# EAGLE design Bandit the Racoon (EAGLE 7.3.0)

## Sheet 1 of 3: Atmega328 + CP2102
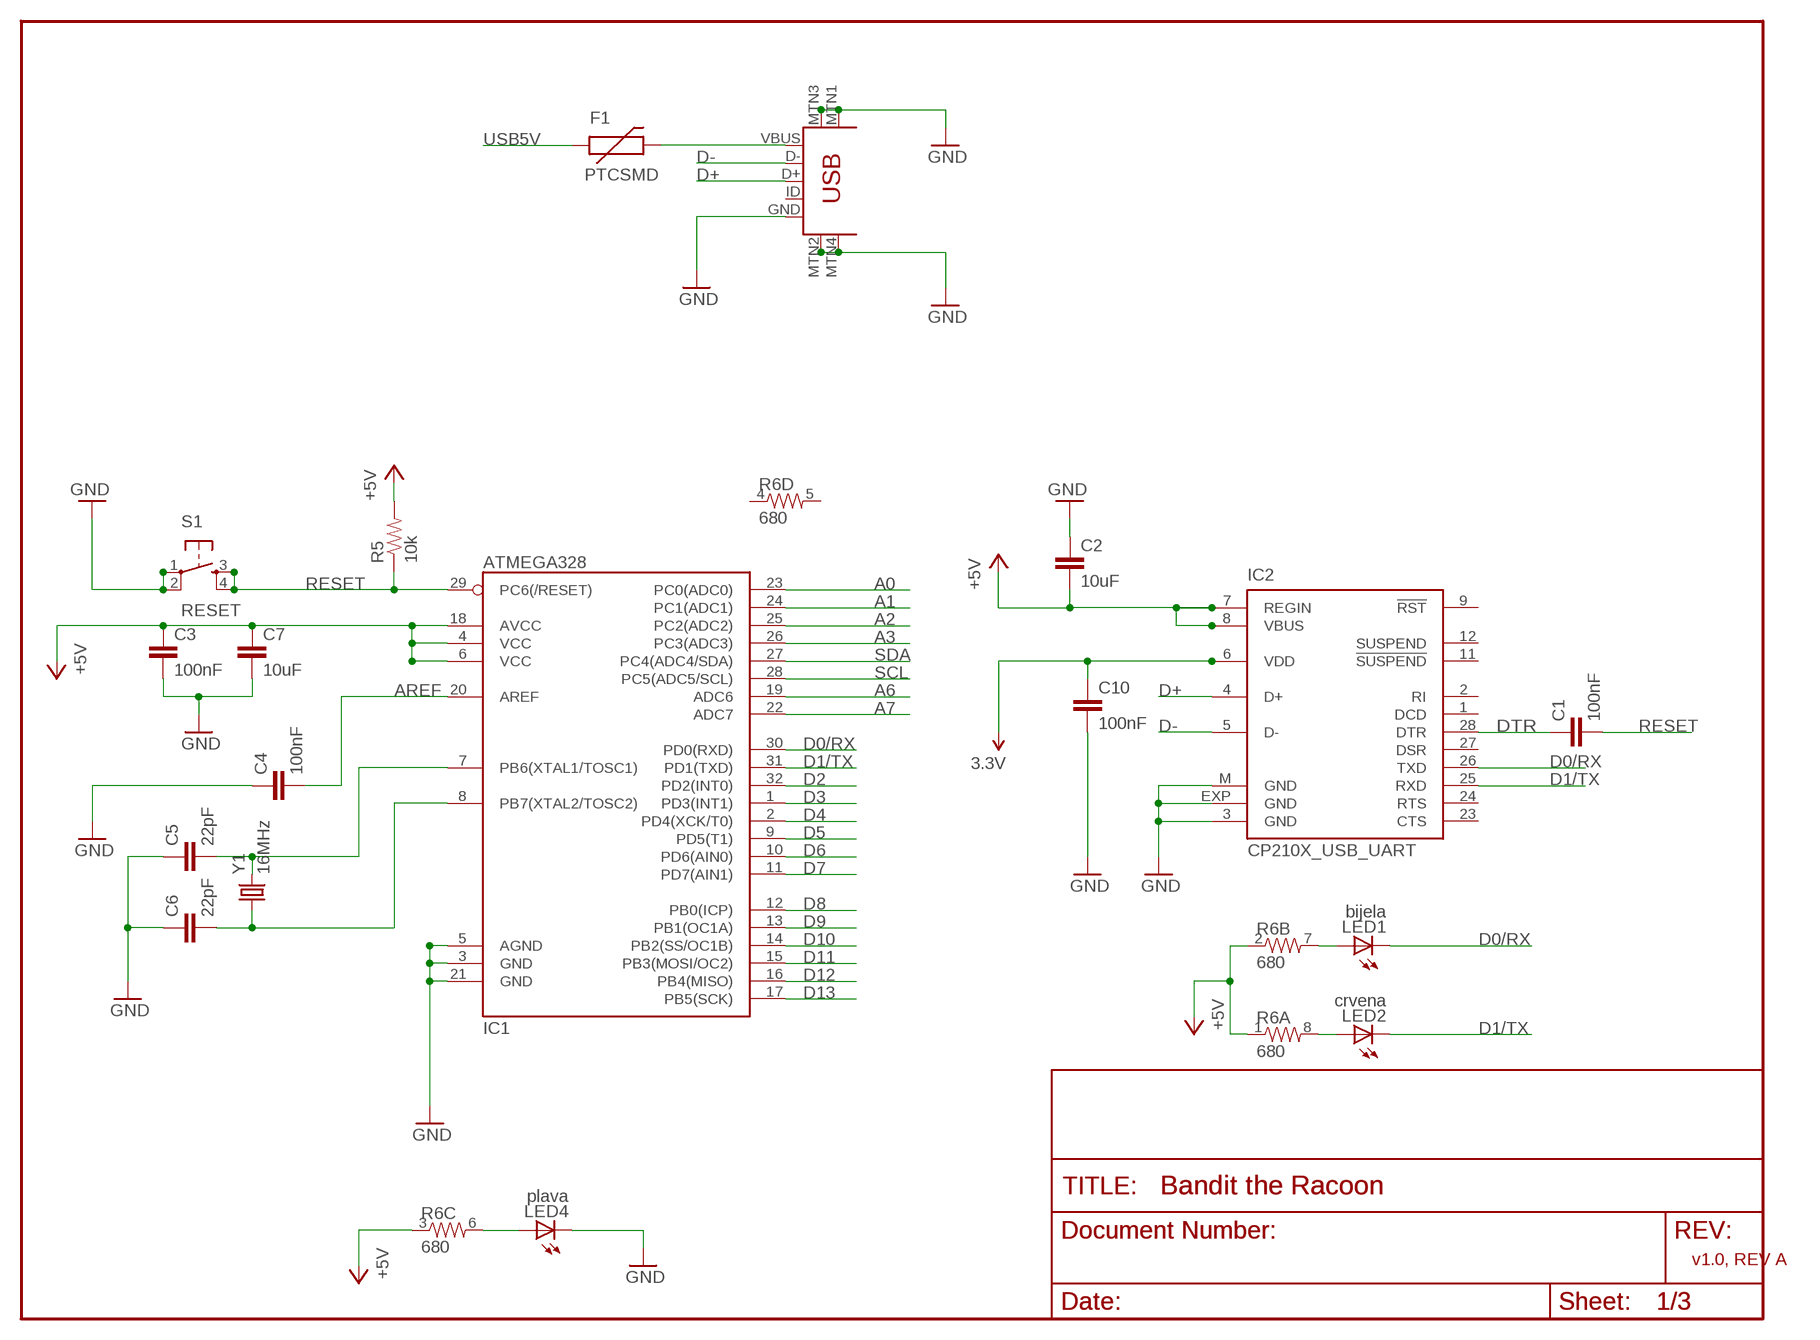
[diagram p0: schematic, sheet 1]

### Parts
C1  100nF  CAP0603-CAP  [0603-CAP]
C2  10uF  C-EUC3216  [C3216]
C3  100nF  CAP0603-CAP  [0603-CAP]
C4  100nF  CAP0603-CAP  [0603-CAP]
C5  22pF  CAP0603-CAP  [0603-CAP]
C6  22pF  CAP0603-CAP  [0603-CAP]
C7  10uF  C-EUC3216  [C3216]
C10  100nF  CAP0603-CAP  [0603-CAP]
F1  PTCSMD  [PTC-1206]
IC1  ATMEGA328  ATMEGA168  [TQFP32-08]
IC2  CP210X_USB_UART  [MLP28]
LED1  bijela  LEDCHIP-LED0805  [CHIP-LED0805]
LED2  crvena  LEDCHIP-LED0805  [CHIP-LED0805]
LED4  plava  LEDCHIP-LED0805  [CHIP-LED0805]
R5  10k  RESISTOR0603-RES  [0603-RES]
R6  680  RESISTOR-ARRAY0603-ARV  [0603-ARV]
S1  RESET  TAC_SWITCHSMD  [TACTILE_SWITCH_SMD]
U1  USB-MINIB  USB-MINIB-5PIN  [USB-MINIB]
Y1  16MHz  CRYSTAL5X3  [CRYSTAL-SMD-5X3]

### Nets
3.3V: C10.1 IC2.6(VDD) ; also sheet 3
+5V: C2.2 C3.1 C7.1 IC1.4(VCC) IC1.6(VCC) IC1.18(AVCC) IC2.7(REGIN) IC2.8(VBUS) R5.2 R6.1 R6.2 R6.3 ; also sheet 2,3
A0: IC1.23(PC0(ADC0)) ; also sheet 3
A1: IC1.24(PC1(ADC1)) ; also sheet 2
A2: IC1.25(PC2(ADC2)) ; also sheet 2
A3: IC1.26(PC3(ADC3)) ; also sheet 3
A6: IC1.19(ADC6)
A7: IC1.22(ADC7)
AREF: C4.2 IC1.20(AREF)
CRYSTAL1: C5.2 IC1.7(PB6(XTAL1/TOSC1)) Y1.3
CRYSTAL2: C6.2 IC1.8(PB7(XTAL2/TOSC2)) Y1.1
D0/RX: IC1.30(PD0(RXD)) IC2.26(TXD) LED1.C ; also sheet 3
D1/TX: IC1.31(PD1(TXD)) IC2.25(RXD) LED2.C ; also sheet 3
D2: IC1.32(PD2(INT0)) ; also sheet 3
D3: IC1.1(PD3(INT1)) ; also sheet 3
D4: IC1.2(PD4(XCK/T0)) ; also sheet 2
D5: IC1.9(PD5(T1)) ; also sheet 3
D6: IC1.10(PD6(AIN0))
D7: IC1.11(PD7(AIN1))
D8: IC1.12(PB0(ICP))
D9: IC1.13(PB1(OC1A)) ; also sheet 3
D10: IC1.14(PB2(SS/OC1B))
D11: IC1.15(PB3(MOSI/OC2))
D12: IC1.16(PB4(MISO))
D13: IC1.17(PB5(SCK))
D+: IC2.4(D+) U1.D+
D-: IC2.5(D-) U1.D-
DTR: C1.1 IC2.28(DTR) ; also sheet 3
GND: C2.1 C3.2 C4.1 C5.1 C6.1 C7.2 C10.2 IC1.3(GND) IC1.5(AGND) IC1.21(GND) IC2.3(GND) IC2.EXP(GND) IC2.M(GND) LED4.C S1.1 S1.2 U1.GND U1.MTN1(MTN2) U1.MTN2(MTN3) U1.MTN3(MTN1) U1.MTN4 ; also sheet 2,3
N$1: LED1.A R6.7
N$2: LED2.A R6.8
N$6: F1.2 U1.VBUS
PLV_LED: LED4.A R6.6
RESET: C1.2 IC1.29(PC6(/RESET)) R5.1 S1.3 S1.4
SCL: IC1.28(PC5(ADC5/SCL)) ; also sheet 3
SDA: IC1.27(PC4(ADC4/SDA)) ; also sheet 3
USB5V: F1.1 ; also sheet 2
Unconnected: IC2.1(DCD) IC2.2(RI) IC2.9(!RST) IC2.11(!SUSPEND) IC2.12(SUSPEND) IC2.23(CTS) IC2.24(RTS) IC2.27(DSR) R6.4 R6.5 U1.ID

### Notes on the sheet
- v1.0, REV A

## Sheet 2 of 3: Battery Charger
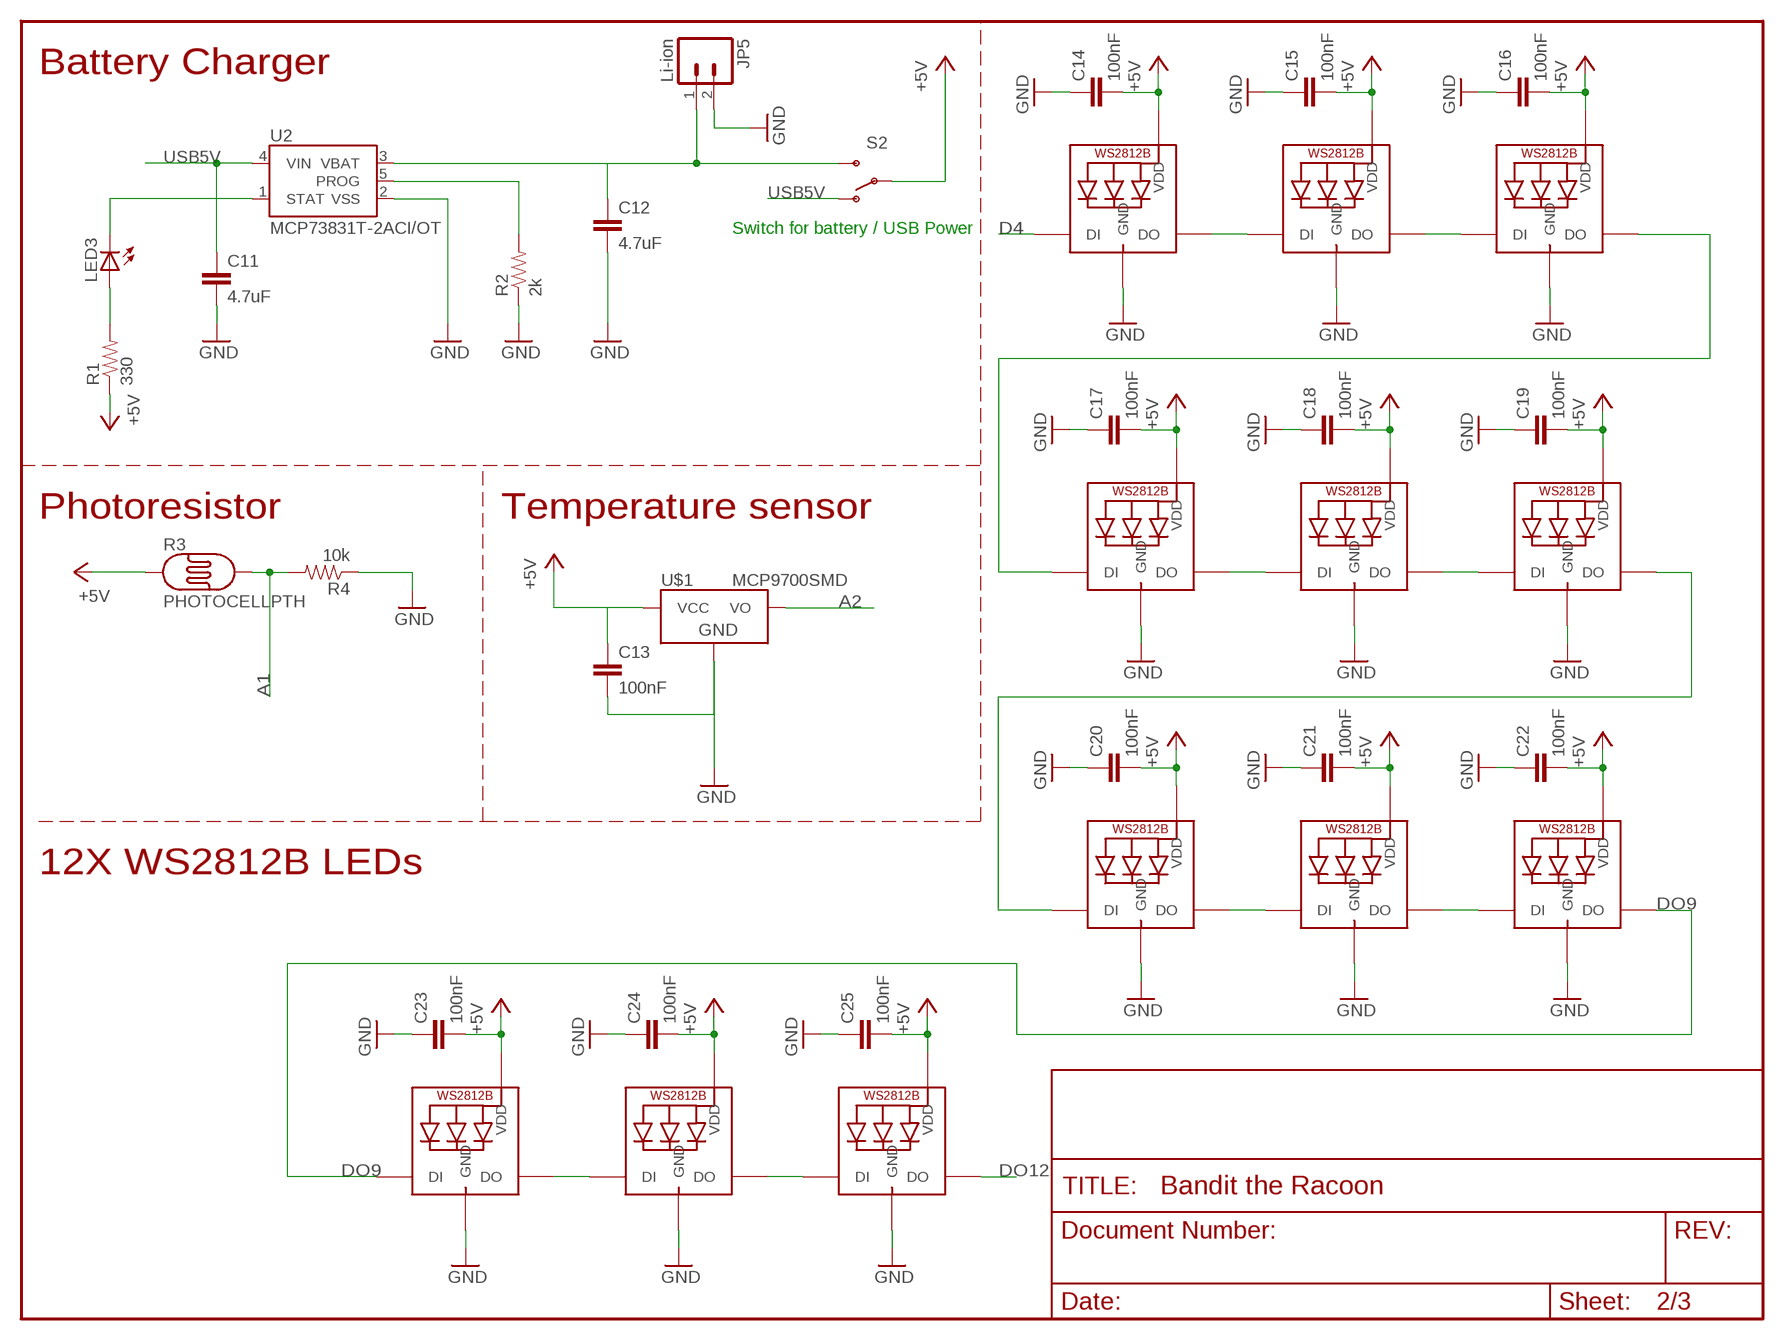
[diagram p1: schematic, sheet 2]

### Parts
C11  4.7uF  CAP0805  [0805]
C12  4.7uF  CAP0805  [0805]
C13  100nF  CAP0603-CAP  [0603-CAP]
C14  100nF  CAP0603-CAP  [0603-CAP]
C15  100nF  CAP0603-CAP  [0603-CAP]
C16  100nF  CAP0603-CAP  [0603-CAP]
C17  100nF  CAP0603-CAP  [0603-CAP]
C18  100nF  CAP0603-CAP  [0603-CAP]
C19  100nF  CAP0603-CAP  [0603-CAP]
C20  100nF  CAP0603-CAP  [0603-CAP]
C21  100nF  CAP0603-CAP  [0603-CAP]
C22  100nF  CAP0603-CAP  [0603-CAP]
C23  100nF  CAP0603-CAP  [0603-CAP]
C24  100nF  CAP0603-CAP  [0603-CAP]
C25  100nF  CAP0603-CAP  [0603-CAP]
JP5  Li-ion  M02JST-PTH-2  [JST-2-PTH]
LED3  LEDCHIPLED_0805  [CHIPLED_0805]
LED5  WS2812B5050  [WS2812B]
LED6  WS2812B5050  [WS2812B]
LED7  WS2812B5050  [WS2812B]
LED8  WS2812B5050  [WS2812B]
LED9  WS2812B5050  [WS2812B]
LED10  WS2812B5050  [WS2812B]
LED11  WS2812B5050  [WS2812B]
LED12  WS2812B5050  [WS2812B]
LED13  WS2812B5050  [WS2812B]
LED14  WS2812B5050  [WS2812B]
LED15  WS2812B5050  [WS2812B]
LED16  WS2812B5050  [WS2812B]
R1  330  RESISTOR0603-RES  [0603-RES]
R2  2k  RESISTOR0603-RES  [0603-RES]
R3  PHOTOCELLPTH  [PHOTOCELL]
R4  10k  RESISTOR0603-RES  [0603-RES]
S2  SWITCH-SPST-SMD-A  [SWITCH-SPST-SMD-A]
U2  MCP73831T-2ACI/OT  MCP73831  [SOT23-5]
U$1  MCP9700SMD  [SOT23-3]

### Nets
+5V: C13.1 C14.2 C15.2 C16.2 C17.2 C18.2 C19.2 C20.2 C21.2 C22.2 C23.2 C24.2 C25.2 LED5.1-VDD(VDD) LED6.1-VDD(VDD) LED7.1-VDD(VDD) LED8.1-VDD(VDD) LED9.1-VDD(VDD) LED10.1-VDD(VDD) LED11.1-VDD(VDD) LED12.1-VDD(VDD) LED13.1-VDD(VDD) LED14.1-VDD(VDD) LED15.1-VDD(VDD) LED16.1-VDD(VDD) R1.1 R3.1 S2.2(P) U$1.1(VCC) ; also sheet 1,3
A1: R3.2 R4.2 ; also sheet 1
A2: U$1.2(VO) ; also sheet 1
D4: LED5.4-DIN(DI) ; also sheet 1
DO1: LED5.2-DOUT(DO) LED6.4-DIN(DI)
DO2: LED6.2-DOUT(DO) LED7.4-DIN(DI)
DO3: LED7.2-DOUT(DO) LED8.4-DIN(DI)
DO4: LED8.2-DOUT(DO) LED9.4-DIN(DI)
DO5: LED9.2-DOUT(DO) LED10.4-DIN(DI)
DO6: LED10.2-DOUT(DO) LED11.4-DIN(DI)
DO7: LED11.2-DOUT(DO) LED12.4-DIN(DI)
DO8: LED12.2-DOUT(DO) LED13.4-DIN(DI)
DO9: LED13.2-DOUT(DO) LED14.4-DIN(DI)
DO10: LED14.2-DOUT(DO) LED15.4-DIN(DI)
DO11: LED15.2-DOUT(DO) LED16.4-DIN(DI)
DO12: LED16.2-DOUT(DO)
GND: C11.2 C12.2 C13.2 C14.1 C15.1 C16.1 C17.1 C18.1 C19.1 C20.1 C21.1 C22.1 C23.1 C24.1 C25.1 JP5.2 LED5.3-GND(GND) LED6.3-GND(GND) LED7.3-GND(GND) LED8.3-GND(GND) LED9.3-GND(GND) LED10.3-GND(GND) LED11.3-GND(GND) LED12.3-GND(GND) LED13.3-GND(GND) LED14.3-GND(GND) LED15.3-GND(GND) LED16.3-GND(GND) R2.1 R4.1 U2.2(VSS) U$1.3(GND) ; also sheet 1,3
N$3: LED3.C U2.1(STAT)
N$4: LED3.A R1.2
N$5: C12.1 JP5.1 S2.3(S) U2.3(VBAT)
N$8: R2.2 U2.5(PROG)
USB5V: C11.1 S2.1(O) U2.4(VIN) ; also sheet 1

### Notes on the sheet
- Battery Charger
- Switch for battery / USB Power
- Photoresistor | Temperature sensor
- 12X WS2812B LEDs

## Sheet 3 of 3
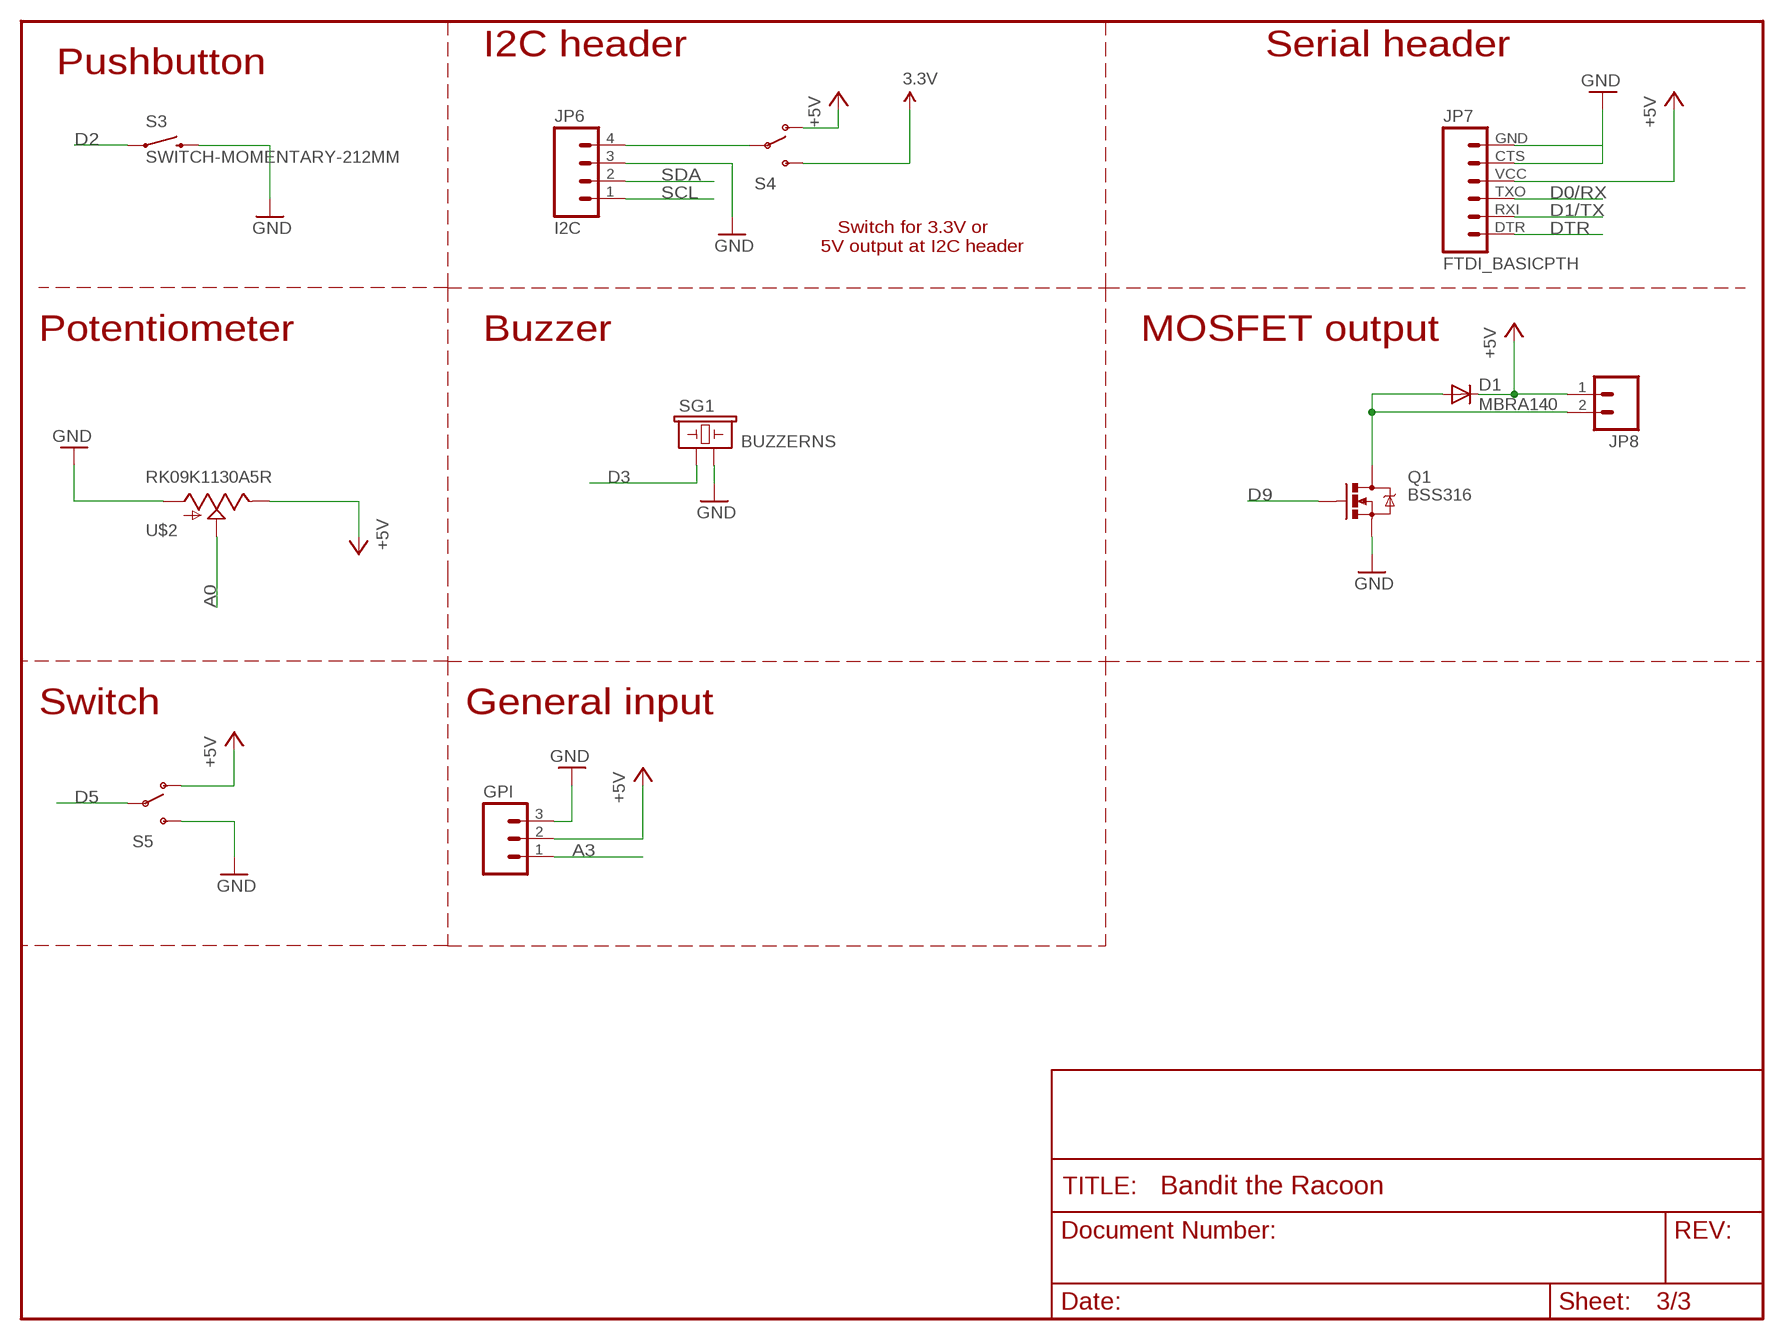
[diagram p2: schematic, sheet 3]

### Parts
D1  MBRA140  DIODESMA  [SMA-DIODE]
GPI  M03LONGPADS  [1X03_LONGPADS]
JP6  I2C  M04LONGPADS  [1X04_LONGPADS]
JP7  FTDI_BASICPTH  [FTDI_BASIC]
JP8  M02PTH  [1X02]
Q1  BSS316  MOSFET-NCHANNELSMD  [SOT23-3]
S3  SWITCH-MOMENTARY-212MM  [TACTILE-PTH-12MM]
S4  SWITCH-SPST-SMD-A  [SWITCH-SPST-SMD-A]
S5  SWITCH-SPSTKIT  [SWITCH-SPDT_KIT]
SG1  BUZZERNS  [BUZZER-12MM-NS]
U$2  RK09K1130A5R  POT  [ALPS_POT]

### Nets
3.3V: S4.3(S) ; also sheet 1
+5V: D1.C GPI.2 JP7.VCC JP8.1 S4.1(O) S5.1(O) U$2.P$1(E) ; also sheet 1,2
A0: U$2.P$2(S) ; also sheet 1
A3: GPI.1 ; also sheet 1
D0/RX: JP7.TXO ; also sheet 1
D1/TX: JP7.RXI ; also sheet 1
D2: S3.1 ; also sheet 1
D3: SG1.+ ; also sheet 1
D5: S5.2(P) ; also sheet 1
D9: Q1.1(G) ; also sheet 1
DTR: JP7.DTR ; also sheet 1
GND: GPI.3 JP6.3 JP7.CTS JP7.GND Q1.2(S) S3.3 S5.3(S) SG1.- U$2.P$3(A) ; also sheet 1,2
N$7: JP6.4 S4.2(P)
N$10: D1.A JP8.2 Q1.3(D)
SCL: JP6.1 ; also sheet 1
SDA: JP6.2 ; also sheet 1

### Notes on the sheet
- I2C header | Serial header
- Pushbutton
- Switch for 3.3V or
  5V output at I2C header
- Potentiometer | Buzzer | MOSFET output
- Switch | General input

## Library data of the parts
C1 C3-C6 C10-C25 = SparkFun:CAP: Capacitor Standard 0603 ceramic capacitor, and 0.1" leaded capacitor.
C2 C7 = rcl:C-EU: CAPACITOR, European symbol
D1 = SparkFun:DIODE: Diode These are standard reverse protection diodes and small signal diodes. SMA package can handle up to about 1A. SOD-323 can handle about 200mA. What the SOD-323 package when ordering, there are some mfgs out there that are 5-pin packages.
F1 = SparkFun:PTC: Resettable Fuse PTC Resettable Fuse. Spark Fun Electronics SKU : COM-08357
GPI = SparkFun:M03: Header 3 Standard 3-pin 0.1" header. Use with straight break away headers (SKU : PRT-00116), right angle break away headers (PRT-00553), swiss pins (PRT-00743), machine pins (PRT-00117), and female headers (PRT-00115). Molex polarized connector foot print use with SKU : PRT-08232 with associated crimp pins and housings.
IC1 = SparkFun:ATMEGA168
IC2 = SparkFun-DigitalIC:CP210X_USB_UART: Single-Chip USB to UART Bridge Source: www.silabs.com .. CP2101.pdf / cp2102.pdf. Spark Fun Electronics SKU : COM-00310
JP5 JP8 = SparkFun:M02: Header 2 Standard 2-pin 0.1" header. Use with straight break away headers (SKU : PRT-00116), right angle break away headers (PRT-00553), swiss pins (PRT-00743), machine pins (PRT-00117), and female headers (PRT-00115). Molex polarized connector foot print use with SKU : PRT-08233 with associated crimp pins and housings.
JP6 = SparkFun:M04: Header 4 Standard 4-pin 0.1" header. Use with straight break away headers (SKU : PRT-00116), right angle break away headers (PRT-00553), swiss pins (PRT-00743), machine pins (PRT-00117), and female headers (PRT-00115). Molex polarized connector foot print use with SKU : PRT-08231 with associated crimp pins and housings. 1MM SMD Version SKU: PRT-10208
JP7 = SparkFun:FTDI_BASIC: FTDI Basic: 3.3V and 5V
LED1-LED4 = adafruit:LED: LED OSRAM: - CHIPLED LG R971, LG N971, LY N971, LG Q971, LY Q971, LO R971, LY R971 LH N974, LH R974 LS Q976, LO Q976, LY Q976 LO Q996 - Hyper CHIPLED LW Q18S LB Q993, LB Q99A, LB R99A - SideLED LS A670, LO A670, LY A670, LG A670, LP A670 LB A673, LV A673, LT A673, LW A673 LH A674 LY A675 LS A676, LA A676, LO A676, LY A676, LW A676 LS A679, LY A679, LG A679 - Hyper Micro SIDELED® LS Y876, LA Y876, LO Y876, LY Y876 LT Y87S - SmartLED LW L88C, LW L88S LB L89C, LB L89S, LG L890 LS L89K, LO L89K, LY L89K LS L896, LA L896, LO L896, LY L896 - TOPLED LS T670, LO T670, LY T670, LG T670, LP T670 LSG T670, LSP T670, LSY T670, LOP T670, LYG T670 LG T671, LOG T671, LSG T671 LB T673, LV T673, LT T673, LW T673 LH T674 LS T676, LA T676, LO T676, LY T676, LB T676, LH T676, LSB T676, LW T676 LB T67C, LV T67C, LT T67C, LS T67K, LO T67K, LY T67K, LW E67C LS E67B, LA E67B, LO E67B, LY E67B, LB E67C, LV E67C, LT E67C LW T67C LS T679, LY T679, LG T679 LS T770, LO T770, LY T770, LG T770, LP T770 LB T773, LV T773, LT T773, LW T773 LH T774 LS E675, LA E675, LY E675, LS T675 LS T776, LA T776, LO T776, LY T776, LB T776 LHGB T686 LT T68C, LB T68C - Hyper Mini TOPLED® LB M676 - Mini TOPLED Santana® LG M470 LS M47K, LO M47K, LY M47K Source: http://www.osram.convergy.de/
LED5-LED16 = adafruit:WS2812B
Q1 = SparkFun:MOSFET-NCHANNEL
R1 R2 R4 R5 = SparkFun:RESISTOR: Resistor Basic schematic elements and footprints for 0603, 1206, and PTH resistors.
R3 = SparkFun:PHOTOCELL: Photocell Also known as a CdS photoresistor. This is a low cost way to detect light levels. Resistance decreases with more incoming light. SparkFun SKU: SEN-09088
R6 = SparkFun:RESISTOR-ARRAY: Array Chip Resistor Source: RS Component / Phycomp
S1 = SparkFun:TAC_SWITCH: Momentary Switch Button commonly used for reset or general input. Spark Fun Electronics SKU : COM-00097
S2 S4 S5 = SparkFun:SWITCH-SPST: SPST Switch Simple slide switch. Spark Fun Electronics SKU : COM-00102
S3 = SparkFun:SWITCH-MOMENTARY-2
SG1 = SparkFun:BUZZER: Buzzer 12mm Spark Fun Electronics SKU : Comp-Buzzer
U1 = SparkFun:USB-MINIB: Mini-USB "B" connector with 5th pin broken out. Created new symbol breaking out 5th "ID" pin in mini/micro USB connector spec. See: http://en.wikipedia.org/wiki/Mini_usb#Cables. Uses same footprint as 4-pin symbol. Also added pins to connect to mounting / shield pads if required (probably not generally needed as signals aren't shielded once they leave the connector).
U2 = SparkFun:MCP73831: Microchip's MCP73831 Miniature single cell, fully integrated Li-Ion, Li-polymer charge management controller http://ww1.microchip.com/downloads/en/DeviceDoc/21984a.pdf
U$1 = SparkFun:MCP9700
U$2 = SparkFun:POT
Y1 = SparkFun:CRYSTAL: Crystals Various standard crystals. Proven footprints. Spark Fun Electronics SKU : COM-00534

## Board
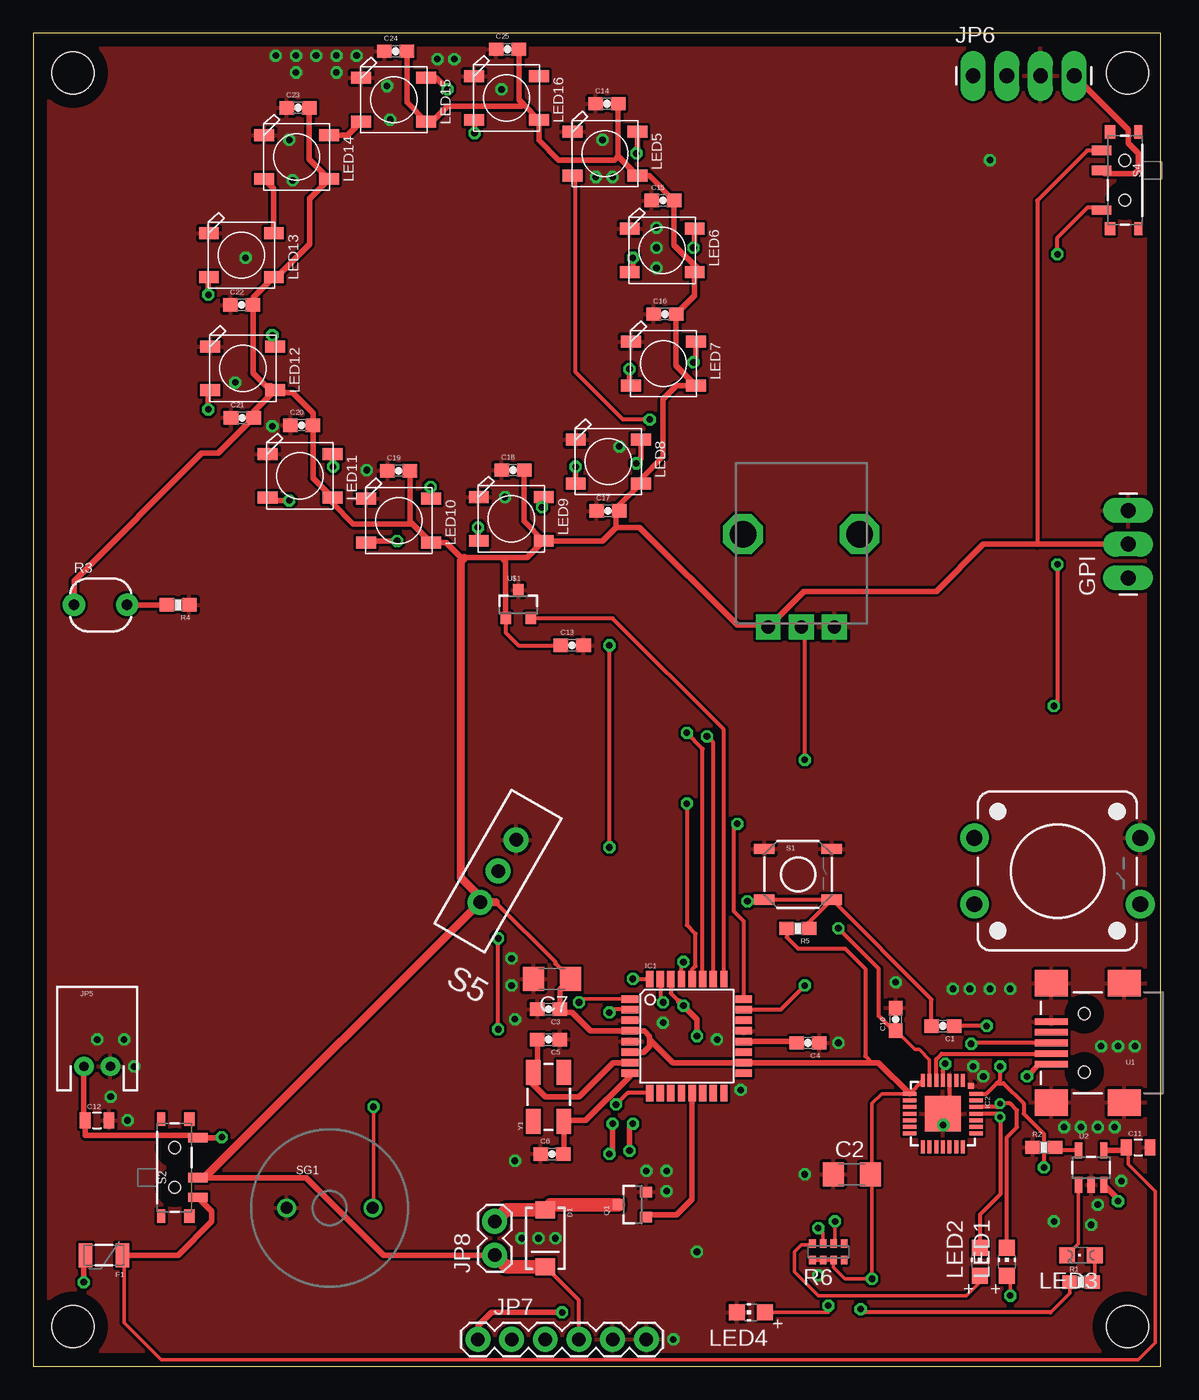
[diagram p3: board, top side]
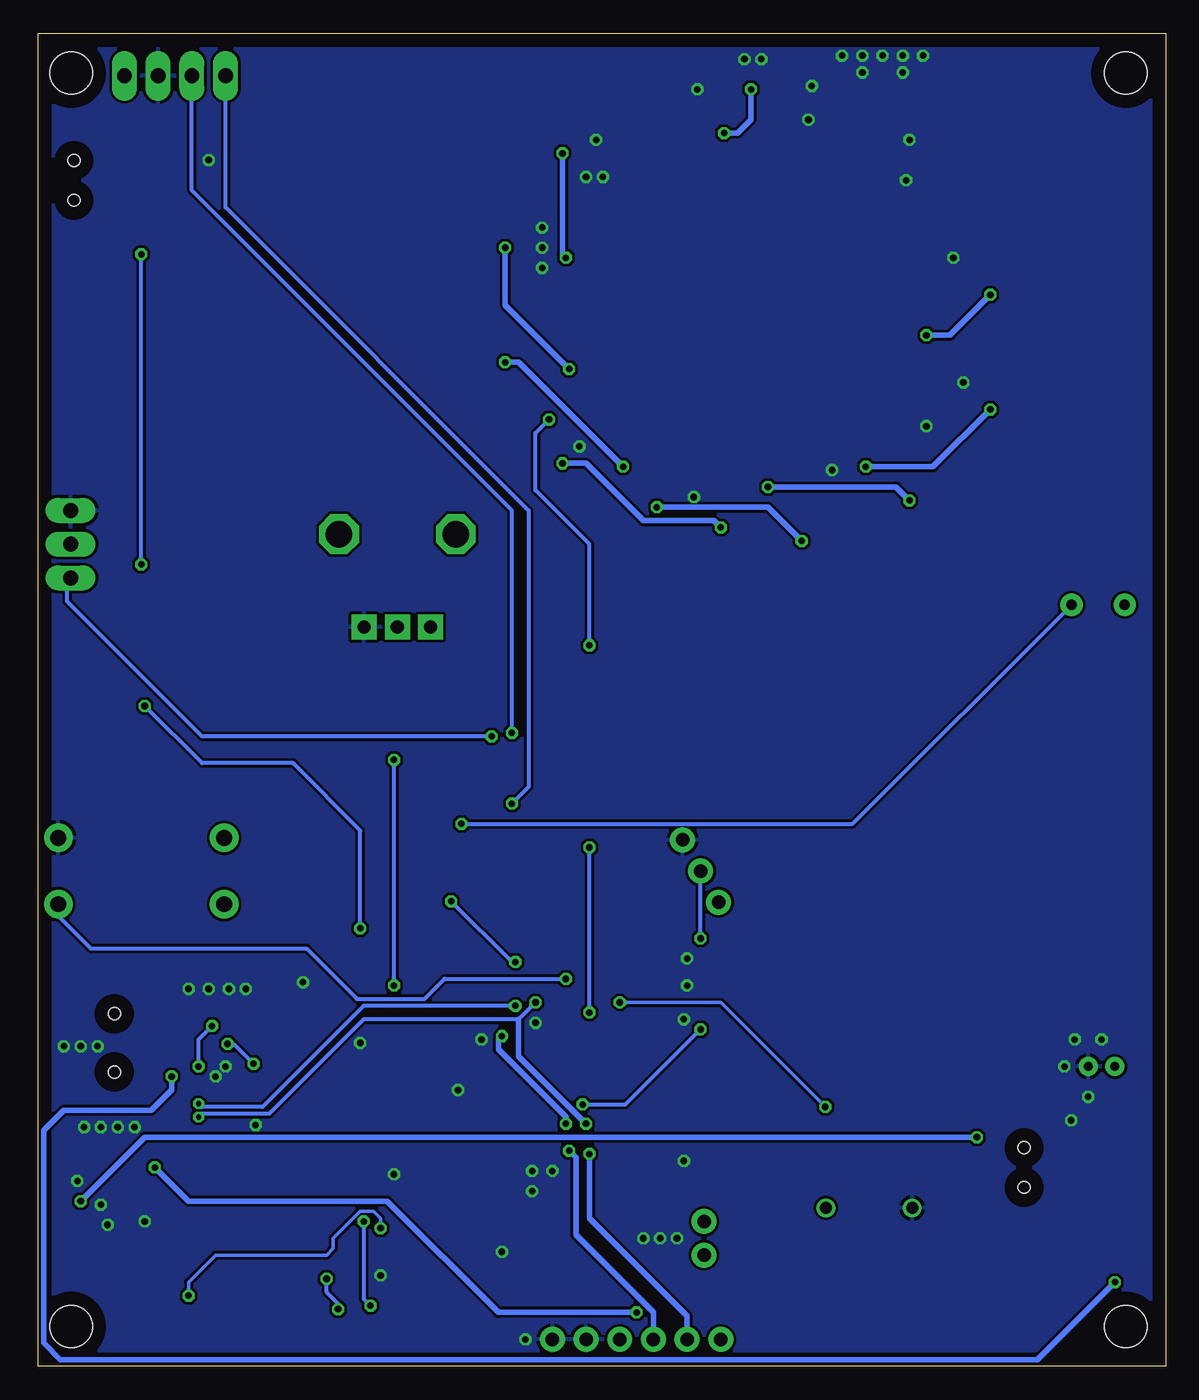
[diagram p4: board, bottom side, seen from below]

Size 85 x 100.5 mm. Coordinates in mm from the lower left corner, seen from the top.
Outline: 0,0 85,0 85,100.5 0,100.5 0,0
Copper layers (1*16): Top 0.035mm / dielectric 1.5mm / Bottom 0.035mm
Design rules "default *": minimum track width 10mil, minimum drill 24mil, track to track 8mil, track to pad 8mil, pad to pad 8mil, via to via 8mil, smd to smd 8mil, copper to edge 40mil, drill to drill 8mil, minimum pad ring 10mil, minimum via ring 8mil, stop-mask expansion 4mil, vias tented up to drill 0.6mm, thermal gap 10mil
Holes 3.2 mm at 3,3 82.5,3 3,97.5 82.5,97.5

### Footprints (pad centres in the part's own frame; a part is rotated, then mirrored left to right if it is on the bottom)
0603-CAP = smd 1.1 x 1: 1 -0.85,0; 2 0.85,0
C3216 = smd 1.6 x 1.8: 1 -1.4,0; 2 1.4,0
0805 = smd 0.8 x 1.2: 1 -0.9,0; 2 0.9,0
SMA-DIODE = smd 1.27 x 1.47: A -2.15,0; C 2.15,0
PTC-1206 = smd 1 x 1.8: 1 -1.4,0; 2 1.4,0
1X03_LONGPADS = drill 1.118 pad 1.88 long: 1 0,0; 2 2.54,0; 3 5.08,0
TQFP32-08 = smd 1.27 x 0.559: 1 -4.293,2.8; 2 -4.293,2; 3 -4.293,1.2; 4 -4.293,0.4; 5 -4.293,-0.4; 6 -4.293,-1.2; 7 -4.293,-2; 8 -4.293,-2.8; 17 4.293,-2.8; 18 4.293,-2; 19 4.293,-1.2; 20 4.293,-0.4; 21 4.293,0.4; 22 4.293,1.2; 23 4.293,2; 24 4.293,2.8 | smd 0.559 x 1.27: 9 -2.8,-4.293; 10 -2,-4.293; 11 -1.2,-4.293; 12 -0.4,-4.293; 13 0.4,-4.293; 14 1.2,-4.293; 15 2,-4.293; 16 2.8,-4.293; 25 2.8,4.293; 26 2,4.293; 27 1.2,4.293; 28 0.4,4.293; 29 -0.4,4.293; 30 -1.2,4.293; 31 -2,4.293; 32 -2.8,4.293
MLP28 = smd 1 x 0.3: 1 -2.5,1.5; 2 -2.5,1; 3 -2.5,0.5; 4 -2.5,0; 5 -2.5,-0.5; 6 -2.5,-1; 7 -2.5,-1.5; 15 2.5,-1.5; 16 2.5,-1; 17 2.5,-0.5; 18 2.5,0; 19 2.5,0.5; 20 2.5,1; 21 2.5,1.5 | smd 0.3 x 1: 8 -1.5,-2.5; 9 -1,-2.5; 10 -0.5,-2.5; 11 0,-2.5; 12 0.5,-2.5; 13 1,-2.5; 14 1.5,-2.5; 22 1.5,2.5; 23 1,2.5; 24 0.5,2.5; 25 0,2.5; 26 -0.5,2.5; 27 -1,2.5; 28 -1.5,2.5 | smd 2.7 x 2.7: EXP 0,0 | smd 0.435 x 0.435: M -2.103,2.103
JST-2-PTH = drill 0.7 pad 1.448: 1 -1,0; 2 1,0
1X04_LONGPADS = drill 1.118 pad 1.88 long: 1 0,0; 2 2.54,0; 3 5.08,0; 4 7.62,0
FTDI_BASIC = drill 1.016 pad 1.88: CTS 10.16,0; DTR 0,0; GND 12.7,0; RXI 2.54,0; TXO 5.08,0; VCC 7.62,0
1X02 = drill 1.016 pad 1.88: 1 0,0; 2 2.54,0
CHIP-LED0805 = smd 1.2 x 1.2: A 0,-1.05; C 0,1.05
CHIPLED_0805 = smd 1.2 x 1.2: A 0,-1.05; C 0,1.05
WS2812B = smd 1.5 x 0.9: 1-VDD 2.45,-1.65; 2-DOUT 2.45,1.65; 3-GND -2.45,1.65; 4-DIN -2.45,-1.65
SOT23-3 = smd 0.8 x 0.9: 1 -0.95,-1; 2 0.95,-1; 3 0,1.1
0603-RES = smd 1.1 x 1: 1 -0.85,0; 2 0.85,0
PHOTOCELL = drill 0.8 pad 1.676: 1 -2,0; 2 2,0
0603-ARV = smd 0.5 x 0.65: 1 -1.2,-0.625; 2 -0.4,-0.625; 3 0.4,-0.625; 4 1.2,-0.625; 5 1.2,0.625; 6 0.4,0.625; 7 -0.4,0.625; 8 -1.2,0.625
TACTILE_SWITCH_SMD = smd 1.524 x 0.762: 1 -2.54,1.905; 2 2.54,1.905; 3 -2.54,-1.905; 4 2.54,-1.905
SWITCH-SPST-SMD-A = smd 0.7 x 1.5: 1 -2.25,-1.75; 2 -0.75,-1.75; 3 2.25,-1.75 | smd 1 x 0.6: GND1 -3.65,1; GND3 3.65,1 | smd 1 x 0.8: GND2 -3.65,-1.1; GND4 3.65,-1.1 | hole 0.9: -1.5,0; 1.5,0
TACTILE-PTH-12MM = drill 1.2 pad 2.159: 1 6.25,-2.5; 2 -6.25,-2.5; 3 6.25,2.5; 4 -6.25,2.5
SWITCH-SPDT_KIT = drill 1.016 pad 1.88: 1 0,2.718; 2 0,0; 3 0,-2.718
BUZZER-12MM-NS = drill 0.9: + 3.25,0; - -3.25,0
USB-MINIB = smd 2.5 x 0.5: D+ 2.5,0; D- 2.5,0.8; GND 2.5,-1.6; ID 2.5,-0.8; VBUS 2.5,1.6 | smd 2.5 x 2: MTN1 -3,4.5; MTN2 2.5,4.5; MTN3 -3,-4.5; MTN4 2.5,-4.5 | hole 0.9: 0,2.2; 0,-2.2
SOT23-5 = smd 0.55 x 1.2: 1 -0.95,-1.3; 2 0,-1.3; 3 0.95,-1.3; 4 0.95,1.3; 5 -0.95,1.3
ALPS_POT = drill 1 pad 1.88 square: P$1 7,-2.5; P$2 7,0; P$3 7,2.5 | drill 2 octagon: P$4 0,-4.4; P$5 0,4.4
CRYSTAL-SMD-5X3 = smd 1.9 x 1.1: 1 -1.85,-1.15; 2 1.85,-1.15; 3 1.85,1.15; 4 -1.85,1.15

### Placement (x,y rotation side)
C1  68.58,25.65 180 top
C2  61.72,14.48 0 top
C3  38.86,26.92 180 top
C4  58.42,24.38 180 top
C5  38.86,24.64 180 top
C6  39.12,16 0 top
C7  39.12,29.21 180 top
C10  65.02,26.16 90 top
C11  83.31,16.51 0 top
C12  4.83,18.54 0 top
C13  40.64,54.36 0 top
C14  43.26,95.17 0 top
C15  47.47,87.88 0 top
C16  47.62,79.32 0 top
C17  43.33,64.49 0 top
C18  36.17,67.56 0 top
C19  27.56,67.51 0 top
C20  20.24,70.94 0 top
C21  15.77,71.5 0 top
C22  15.72,80.01 0 top
C23  19.96,94.87 0 top
C24  27.33,99.14 0 top
C25  35.76,99.29 0 top
D1  38.61,9.65 270 top
F1  5.33,8.38 180 top
GPI  82.55,59.44 90 top
IC1  49.28,24.89 0 top
IC2  68.58,19.05 270 top
JP5  4.83,22.61 0 top
JP6  70.87,97.28 0 top
JP7  33.53,2.03 0 top
JP8  34.8,8.38 90 top
LED1  73.41,7.87 0 top
LED2  71.37,7.87 0 top
LED3  78.99,8.38 90 top
LED4  54.1,4.06 90 top
LED5  43.1,91.41 0 top
LED6  47.42,84.12 0 top
LED7  47.52,75.59 0 top
LED8  43.36,68.2 0 top
LED9  36.04,63.88 0 top
LED10  27.56,63.75 0 top
LED11  20.12,67.13 0 top
LED12  15.8,75.23 0 top
LED13  15.7,83.77 0 top
LED14  19.86,91.16 0 top
LED15  27.18,95.48 0 top
LED16  35.69,95.61 0 top
Q1  45.21,12.19 90 top
R1  78.99,6.35 0 top
R2  76.2,16.51 0 top
R3  5.08,57.4 0 top
R4  10.92,57.4 180 top
R5  57.66,33.02 180 top
R6  59.94,8.64 0 top
S1  57.66,37.08 0 top
S2  10.67,14.99 90 top
S3  77.22,37.34 0 top
S4  82.3,89.41 270 top
S5  35.05,37.34 150 top
SG1  22.35,11.94 0 top
U1  79.25,24.38 180 top
U2  79.76,14.99 0 top
U$1  36.58,57.4 0 top
U$2  57.91,62.74 270 top
U$3  [BANDIT_THE_RACOON]  0,0 0 top
U$4  [E-RADIONICA.COM_MADE_IN_BACK!]  6.86,1.27 0 top
U$5  [OSH3MM]  48.01,96.52 0 top
U$6  [E-RADIONICA.COM_MADE_IN]  55.91,96.62 0 top
U$7  [NOVI_LOGO-4MM]  51.31,96.01 0 top
U$8  [LUDI_LOGO_BACK]  19.3,1.02 0 top
Y1  38.86,20.32 90 top

### Tracks (layer width: path | path; a pad name or v marks a point on that pad's centre or on a via)
3.3V  (via drill 0.5)
  Top 0.254: IC2.6 67.58,23.1 66.8,23.88 66.46,23.88 C10.1
  Top 0.305: C10.1 64.86,25.31 63.75,26.42 63.75,29.97 v60.71,33.02 | v77.22,83.83 77.22,85.09 79.5,87.38 80.33,87.38 S4.3 | v77.22,60.45 77.22,50.04 v76.96,49.78
  Bottom 0.305: v60.71,33.02 60.71,40.39 65.79,45.47 72.64,45.47 v76.96,49.78 | v77.22,60.45 v77.22,83.83
+5V  (via drill 0.5)
  Top 0.254: R6.1 R6.2 R6.3 60.34,7.47 61.21,6.6 v63.25,6.6 63.25,14.35 C2.2 63.25,14.6 63.25,19.81 63.98,20.55 IC2.8 | R1.1 78.14,5.5 76.71,4.06
  Top 0.305: JP7.VCC 41.15,4.96 D1.C | U$1.1 35.63,55.31 36.58,54.36 C13.1 | IC2.8 IC2.7 | S5.1 34.87,34.98 39.37,30.48 39.37,30.36 C7.1 | R5.2 56.81,32.35 57.66,31.5 61.21,31.5 62.74,29.97 62.74,23.4 63.25,22.89 | S4.1 79.47,91.66 75.69,87.88 75.69,61.98 | 76.71,4.06 62.64,4.06 v62.38,4.32
  Top 0.406: C25.2 36.61,95.48 36.96,95.13 | 36.96,95.13 LED16.1-VDD 38.14,92.42 39.62,90.93 43.83,90.93 44.11,91.21 | C14.2 44.11,91.21 | 44.11,91.21 LED5.1-VDD 46.45,89.76 C15.2 48.32,84.52 50.29,82.55 49.95,82.55 LED6.1-VDD 49.87,80.72 C16.2 48.48,75.44 LED7.1-VDD 49.95,73.91 48.51,73.91 47.5,72.9 47.5,68.58 45.81,66.89 LED8.1-VDD 44.18,64.92 C17.2 43.94,64.25 43.94,63.25 | LED9.1-VDD 42.93,62.23 43.94,63.25 | C18.2 37.02,63.7 LED9.1-VDD | C19.2 28.41,63.7 28.53,63.58 | 28.53,63.58 LED10.1-VDD 31.11,62.1 32.26,60.96 32.51,60.96 35.31,60.96 | 35.31,60.96 37.22,60.96 LED9.1-VDD | 28.53,63.58 28.45,63.5 24.13,63.5 22.57,65.06 LED11.1-VDD 21.09,66.95 C20.2 21.09,71.87 19.56,73.41 18.43,73.41 LED12.1-VDD | LED12.1-VDD 16.62,71.96 C21.2 13.96,68.83 12.7,68.83 3.08,59.21 R3.1 | LED12.1-VDD 17.92,73.91 17.53,73.91 16.57,74.87 C22.2 16.57,80.55 LED13.1-VDD 18.36,82.12 20.83,84.58 20.83,88.03 LED14.1-VDD 20.81,91.01 C23.2 | C24.2 28.18,95.28 LED15.1-VDD 30.07,93.83 31.24,95 36.83,95 36.96,95.13 | U$1.1 35.63,60.64 35.31,60.96 | 43.94,63.25 45.72,63.25 53.09,55.88 55.27,55.88 U$2.P$1 58.09,58.42 68.07,58.42 71.63,61.98 75.69,61.98 GPI.2 | C7.1 39.71,28.41 C3.1 39.97,26.67 40.64,26.67 42.02,25.29 IC1.4 46.08,25.29 46.48,24.89 46.48,24.64 | 46.48,24.64 46.48,24.13 46.02,23.67 45,23.67 IC1.6 | 46.48,24.64 48.23,22.89 IC1.18 63.25,22.89 63.74,22.89 IC2.8 | JP8.1 26.42,8.38 20.57,14.22 12.43,14.22 S2.2
  Top 0.61: S2.2 12.95,14.24 S5.1 | 34.87,34.98 34.1,34.98 32.26,36.83 32.26,60.71 32.51,60.96
  Top 1.016: D1.C 35.68,7.5 JP8.1
  Bottom 0.305: v62.38,4.32 62.38,4.72 63.25,5.59 v63.25,6.6
A0  (via drill 0.5)
  Top 0.305: IC1.23 56.36,26.89 v58.17,28.7 | v58.17,45.72 58.17,55.48 U$2.P$2
  Bottom 0.305: v58.17,28.7 v58.17,45.72
A1  (via drill 0.5)
  Top 0.305: IC1.24 53.57,33.55 52.83,34.29 52.83,40.64 v53.09,40.89
  Top 0.406: R3.2 R4.2
  Bottom 0.305: v53.09,40.89 23.59,40.89 R3.2
A2
  Top 0.305: IC1.25 52.08,48 43.69,56.39 37.54,56.39 U$1.2
A3  (via drill 0.5)
  Top 0.305: IC1.26 51.28,47.02 v50.8,47.5
  Bottom 0.305: v50.8,47.5 72.64,47.5 82.8,57.66 82.8,59.18 GPI.1
AREF
  Top 0.406: IC1.20 57.46,24.49 C4.2
CRYSTAL1
  Top 0.406: C5.2 38.01,22.47 Y1.3 37.59,22.05 37.59,21.34 38.61,20.32 41.15,20.32 43.72,22.89 IC1.7
CRYSTAL2
  Top 0.406: C6.2 40.01,16.05 Y1.1 40.08,18.54 41.66,18.54 44.98,21.87 IC1.8
D0/RX  (via drill 0.4, 0.5)
  Top 0.305: IC1.30 48.08,28.12 48.64,27.56 v49.02,27.18 | IC2.26 72.64,19.56 v72.9,19.81 73.66,19.81 74.17,19.3 74.17,18.03 73.41,17.27 LED1.C
  Top 0.406: v44.96,16.26 44.96,18.03 v45.21,18.29 | v50.04,24.89 50.04,26.16 48.64,27.56
  Bottom 0.305: v49.02,27.18 60.45,27.18 68.07,19.56 72.64,19.56 v72.9,19.81
  Bottom 0.406: JP7.TXO 38.61,4.06 44.45,9.91 44.45,15.75 v44.96,16.26 | v45.21,18.29 45.21,18.8 50.29,23.88 50.29,24.64 v50.04,24.89
D1/TX  (via drill 0.4, 0.5)
  Top 0.305: IC1.31 47.28,27.65 v47.5,27.43 | IC2.25 72.64,19.05 v72.9,18.8 72.9,12.95 71.37,11.43 LED2.C
  Top 0.406: v43.69,18.29 43.69,16.26 v43.43,16
  Bottom 0.305: v47.5,27.43 48.77,26.16 60.45,26.16 67.56,19.05 72.64,19.05 v72.9,18.8
  Bottom 0.406: 48.77,26.16 48.77,23.37 v43.69,18.29 | v43.43,16 43.43,11.18 36.07,3.81 JP7.RXI
D2  (via drill 0.5)
  Top 0.305: v45.21,29.21 46.45,29.21 IC1.32
  Bottom 0.305: S3.1 83.47,33.94 81.03,31.5 64.77,31.5 60.96,27.69 55.88,27.69 54.36,29.21 v45.21,29.21
D3  (via drill 0.5)
  Top 0.254: IC1.1 41.41,27.69 v41.15,27.43 | v25.65,19.56 25.65,11.99 SG1.+
  Bottom 0.254: v41.15,27.43 33.53,27.43 v25.65,19.56
D4  (via drill 0.5)
  Top 0.305: IC1.2 43.66,26.89 v43.43,26.67 | v43.43,39.12 v43.43,54.36 | v46.48,71.37 44.45,71.37 40.89,74.93 40.89,89.52 LED5.4-DIN
  Bottom 0.305: v43.43,26.67 v43.43,39.12 | v43.43,54.36 43.43,61.98 47.5,66.04 47.5,70.36 v46.48,71.37
D5  (via drill 0.5)
  Top 0.305: IC1.9 44.81,20.6 v43.94,19.74 | v35.05,25.4 v35.05,32.26
  Bottom 0.305: v43.94,19.74 40.72,19.74 v35.05,25.4 | v35.05,32.26 S5.2
D9
  Top 0.406: IC1.13 49.68,12.59 48.51,11.43 46.4,11.43 Q1.1
D+  (via drill 0.5)
  Top 0.305: U1.D+ 70.79,24.38 v70.71,24.31 | v68.76,22.81 68.76,22.48 68.58,22.3 IC2.4
  Bottom 0.305: v70.71,24.31 70.26,24.31 v68.76,22.81
D-
  Top 0.305: IC2.5 68.08,23.15 68.5,23.57 76.73,23.57 U1.D-
DO1  (via drill 0.5)
  Top 0.406: LED5.2-DOUT 45.55,91.53 v45.47,91.44 | v45.21,83.57 45.21,82.72 LED6.4-DIN
  Bottom 0.406: v45.47,91.44 45.47,83.82 v45.21,83.57
DO2  (via drill 0.5)
  Top 0.406: LED6.2-DOUT 49.87,84.42 v49.78,84.33 | v44.96,75.18 44.96,74.06 LED7.4-DIN
  Bottom 0.406: v49.78,84.33 49.78,80.01 v44.96,75.18
DO3  (via drill 0.5)
  Top 0.406: LED7.2-DOUT 49.97,75.88 v49.78,75.69 | v40.89,67.82 40.89,66.56 LED8.4-DIN
  Bottom 0.406: v49.78,75.69 48.77,75.69 v40.89,67.82
DO4  (via drill 0.5)
  Top 0.406: LED8.2-DOUT 45.81,68.41 v45.47,68.07 | v33.53,63.25 33.53,62.3 LED9.4-DIN
  Bottom 0.406: v45.47,68.07 43.69,68.07 39.37,63.75 34.04,63.75 v33.53,63.25
DO5  (via drill 0.5)
  Top 0.406: LED9.2-DOUT 38.49,64.91 v38.35,64.77 | v27.43,62.23 25.23,62.23 LED10.4-DIN
  Bottom 0.406: v38.35,64.77 29.97,64.77 v27.43,62.23
DO6  (via drill 0.5)
  Top 0.406: LED10.2-DOUT 30.01,66.26 v29.97,66.29 | v19.3,65.28 17.87,65.28 LED11.4-DIN
  Bottom 0.406: v29.97,66.29 20.32,66.29 v19.3,65.28
DO7  (via drill 0.5)
  Top 0.406: LED11.2-DOUT 22.57,67.86 v22.61,67.82 | v13.21,72.14 13.21,73.44 LED12.4-DIN
  Bottom 0.406: v22.61,67.82 17.53,67.82 v13.21,72.14
DO8  (via drill 0.5)
  Top 0.406: LED12.2-DOUT 18.25,77.51 v18.03,77.72 | v13.21,80.77 13.21,82.08 LED13.4-DIN
  Bottom 0.406: v18.03,77.72 16.26,77.72 v13.21,80.77
DO9
  Top 0.406: LED13.2-DOUT 18.15,88.78 LED14.4-DIN
DO10
  Top 0.406: LED14.2-DOUT 23.71,92.81 LED15.4-DIN
DO11  (via drill 0.5)
  Top 0.406: LED15.2-DOUT 30.38,97.13 v31.24,96.27 | v33.27,92.96 33.27,93.92 LED16.4-DIN
  Bottom 0.406: v31.24,96.27 31.24,93.98 32.26,92.96 v33.27,92.96
DTR  (via drill 0.5)
  Top 0.305: IC2.28 71.86,20.55 72.64,21.34 | 72.64,21.34 72.9,21.59 v72.9,22.61 | v71.88,25.65 C1.1 | 72.64,21.34 73.15,21.34 74.68,19.81 74.68,19.05 76.2,17.53 v76.2,14.99
  Top 0.406: JP7.DTR 33.53,3.05 34.54,4.06 v39.88,4.06
  Bottom 0.305: v72.9,22.61 72.9,24.64 v71.88,25.65
  Bottom 0.406: v39.88,4.06 50.29,4.06 58.67,12.45 73.66,12.45 75.95,14.73 v76.2,14.99
GND  (via drill 0.5)
  Top 0.305: IC2.3 69.08,19.55 IC2.EXP
  other vias: 77.72,18.03 78.99,18.03 80.26,18.03 81.53,18.03 68.61,18.19 70.87,22.61 71.63,21.84 83.06,24.13 81.79,24.13 80.52,24.13 73.66,28.45 72.14,28.45 70.61,28.45 69.34,28.45 60.71,24.38 65.02,28.96 51.56,24.64 47.5,25.91 53.34,20.83 58.17,14.48 36.07,30.73 36.07,28.7 36.32,26.16 36.32,15.49 4.83,24.64 6.86,24.64 5.84,20.32 7.11,18.54 39.37,9.65 38.1,9.65 36.83,9.65 46.23,14.73 47.75,14.73 47.75,13.21 50.04,8.64 59.18,6.86 76.96,10.92 80.26,12.19 79.76,10.67 82.04,13.97 48.26,2.03 7.62,22.61 30.48,98.55 24.38,98.81 22.86,98.81 21.34,98.81 19.81,98.81 18.29,98.81 31.75,98.55 26.67,96.52 22.86,97.54 19.81,97.54 19.3,92.46 42.42,89.66 43.69,89.66 46.99,85.85 46.99,84.33 46.99,82.8 18.03,70.87 25.15,67.56 35.56,65.53 44.2,69.34 15.24,74.17 16,83.57 19.56,89.41 26.92,93.98 35.31,96.27 42.93,92.46 72.14,90.93
  pour Top: 0,0 84.99,0 84.99,100.51 0,100.51
  pour Bottom: 0,0 84.99,0 84.99,100.51 0,100.51
N$1  (via drill 0.5)
  Top 0.254: R6.7 59.54,10.05 v59.18,10.41 | v73.66,5.33 73.66,6.57 LED1.A
  Bottom 0.254: v59.18,10.41 59.18,11.18 59.69,11.68 60.71,11.68 62.74,9.65 62.74,8.89 63.25,8.38 71.63,8.38 73.66,6.35 v73.66,5.33
N$2
  Top 0.254: LED2.A 71.37,6.35 70.36,5.33 59.18,5.33 57.4,7.11 57.4,8.64 57.91,9.14 58.63,9.14 R6.8
N$3
  Top 0.254: U2.1 78.81,9.24 LED3.C
N$4
  Top 0.254: LED3.A 80.04,6.55 R1.2
N$5  (via drill 0.5)
  Top 0.406: JP5.1 3.83,18.64 C12.1 3.93,17.41 12.42,17.41 S2.3 14.19,17.24 v14.22,17.27 | v81.79,12.45 81.79,12.6 U2.3
  Bottom 0.406: v14.22,17.27 76.96,17.27 v81.79,12.45
N$6  (via drill 0.5)
  Top 0.406: U1.VBUS 75.87,22.78 v74.93,21.84 | v3.81,6.35 3.81,8.26 F1.2
  Bottom 0.406: v74.93,21.84 74.93,20.83 76.45,19.3 83.06,19.3 84.58,17.78 84.58,1.78 83.31,0.51 9.65,0.51 v3.81,6.35
N$7
  Top 0.406: S4.2 80.79,89.92 83.06,89.92 83.31,90.17 83.31,91.44 82.55,92.2 82.55,93.22 JP6.4
N$8
  Top 0.305: U2.5 77.27,16.29 R2.2
N$10
  Top 1.016: JP8.2 35.68,11.8 D1.A 39,12.19 Q1.3
PLV_LED  (via drill 0.5)
  Top 0.254: LED4.A 59.94,4.06 v59.94,4.57 | v60.45,10.92 60.45,9.37 R6.6
  Bottom 0.305: v60.45,10.92 60.45,5.08 v59.94,4.57
RESET  (via drill 0.5)
  Top 0.305: C1.2 67.73,27.65 S1.4 | R5.1 58.51,33.49 S1.4 | S1.4 S1.3 54.99,35.05 v53.85,35.05 | IC1.29 48.88,30.33 v49.02,30.48
  Bottom 0.305: v49.02,30.48 49.28,30.48 v53.85,35.05
SCL  (via drill 0.5)
  Top 0.305: v49.28,42.42 49.28,33.27 49.94,32.61 49.94,30.18 49.68,29.91 IC1.28
  Bottom 0.305: v49.28,42.42 48.01,43.69 48.01,64.52 70.87,87.38 JP6.1
SDA  (via drill 0.5)
  Top 0.305: IC1.27 50.48,46.55 v49.28,47.75
  Bottom 0.305: v49.28,47.75 49.28,64.52 73.41,88.65 JP6.2
USB5V
  Top 0.254: 82.55,16.26 82.55,15.24 84.58,13.21 84.58,1.78 83.31,0.51 9.65,0.51 6.86,3.3 6.86,8.26 F1.1
  Top 0.305: U2.4 82.19,16.29 C11.1
  Top 0.406: F1.1 10.92,8.38 13.46,10.92 13.46,11.69 S2.1 | U2.4 82.52,16.29 82.55,16.26

### Text on the board
200bmp: RESET / ATMEGA | * | *